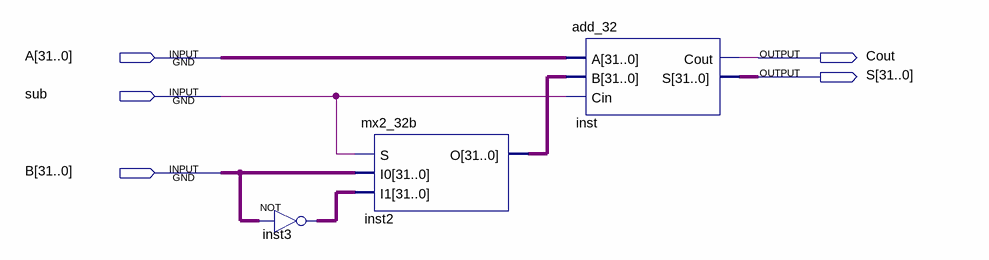
[diagram p0: schematic sheet]
// Quartus schematic add_sub_32.bdf as structural Verilog: 3 symbols, 5 pins
module add_sub_32 (
  input  [31:0] A,
  input  sub,
  input  [31:0] B,
  output Cout,
  output [31:0] S
);

  wire [31:0] inst2_o, inst3_out;

  assign inst3_out = ~B;  // NOT inst3, 32 bits wide
  mx2_32b inst2 (.S(sub), .I0(B), .I1(inst3_out), .O(inst2_o));
  add_32 inst (.A(A), .B(inst2_o), .Cin(sub), .Cout(Cout), .S(S));
endmodule
